# Altium schematic sheet Sheet3.SchDoc
size A4
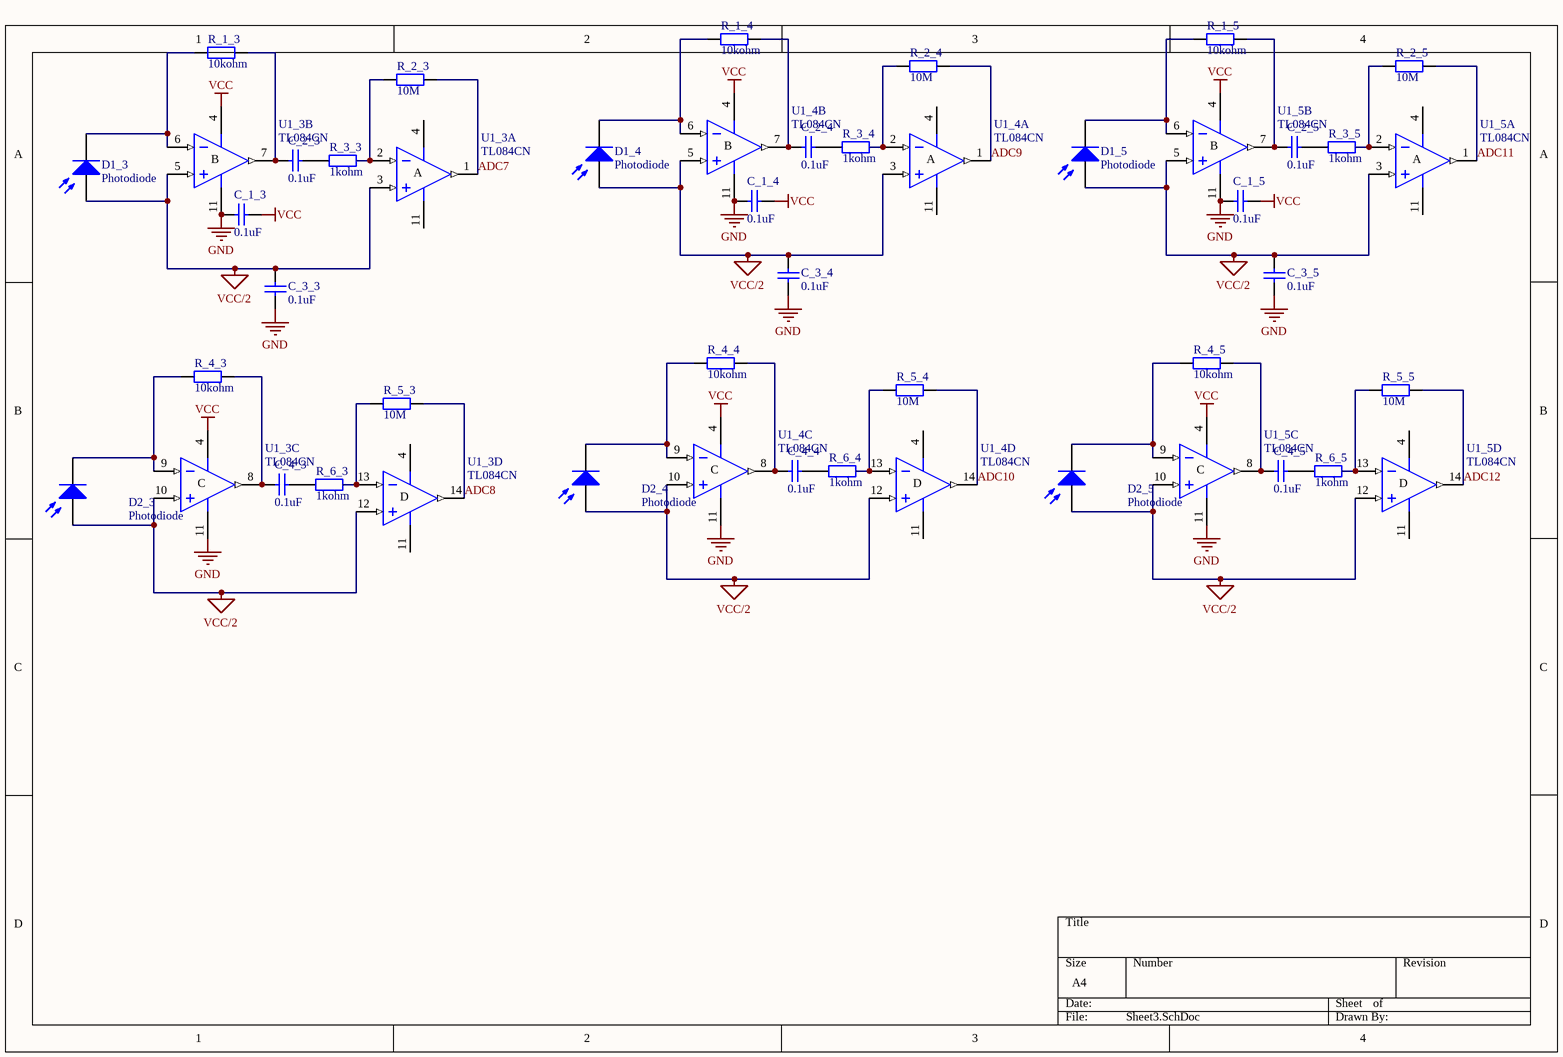
[diagram p0: Sheet3.SchDoc]

## Parts
C_1_3  0.1uF  [cms805 - mini]
C_1_4  0.1uF  [cms805 - mini]
C_1_5  0.1uF  [cms805 - mini]
C_2_3  0.1uF  [cms805 - mini]
C_2_4  0.1uF  [cms805 - mini]
C_2_5  0.1uF  [cms805 - mini]
C_3_3  0.1uF  [cms805 - mini]
C_3_4  0.1uF  [cms805 - mini]
C_3_5  0.1uF  [cms805 - mini]
C_4_3  0.1uF  [cms805 - mini]
C_4_4  0.1uF  [cms805 - mini]
C_4_5  0.1uF  [cms805 - mini]
D1_3  Photodiode  [TEMD1000]
D1_4  Photodiode  [TEMD1000]
D1_5  Photodiode  [TEMD1000]
D2_3  Photodiode  [TEMD1000]
D2_4  Photodiode  [TEMD1000]
D2_5  Photodiode  [TEMD1000]
R_1_3  10kohm  [cms805 - mini]
R_1_4  10kohm  [cms805 - mini]
R_1_5  10kohm  [cms805 - mini]
R_2_3  10M  [cms805 - mini]
R_2_4  10M  [cms805 - mini]
R_2_5  10M  [cms805 - mini]
R_3_3  1kohm  [cms805 - mini]
R_3_4  1kohm  [cms805 - mini]
R_3_5  1kohm  [cms805 - mini]
R_4_3  10kohm  [cms805 - mini]
R_4_4  10kohm  [cms805 - mini]
R_4_5  10kohm  [cms805 - mini]
R_5_3  10M  [cms805 - mini]
R_5_4  10M  [cms805 - mini]
R_5_5  10M  [cms805 - mini]
R_6_3  1kohm  [cms805 - mini]
R_6_4  1kohm  [cms805 - mini]
R_6_5  1kohm  [cms805 - mini]
U1_3  TL084CN  [TSSOP14]  (parts A,B,C,D of 4)
U1_4  TL084CN  [TSSOP14]  (parts A,B,C,D of 4)
U1_5  TL084CN  [TSSOP14]  (parts A,B,C,D of 4)

## Nets
GND: C_1_3.1 C_1_4.1 C_1_5.1 C_3_3.1 C_3_4.1 C_3_5.1 U1_3.11(V-) U1_4.11(V-) U1_5.11(V-)
VCC: C_1_3.2 C_1_4.2 C_1_5.2 U1_3.4(V+) U1_4.4(V+) U1_5.4(V+)
VCC/2: C_3_3.2 C_3_4.2 C_3_5.2 D1_3.1(A) D1_4.1(A) D1_5.1(A) D2_3.1(A) D2_4.1(A) D2_5.1(A) U1_3.3(IN+) U1_3.5(IN+) U1_3.10(IN+) U1_3.12(IN+) U1_4.3(IN+) U1_4.5(IN+) U1_4.10(IN+) U1_4.12(IN+) U1_5.3(IN+) U1_5.5(IN+) U1_5.10(IN+) U1_5.12(IN+)
ADC7: R_2_3.2 U1_3.1(OUT)
ADC8: R_5_3.2 U1_3.14(OUT)
ADC9: R_2_4.2 U1_4.1(OUT)
ADC10: R_5_4.2 U1_4.14(OUT)
ADC11: R_2_5.2 U1_5.1(OUT)
ADC12: R_5_5.2 U1_5.14(OUT)
NetC_2_3_1: C_2_3.1 R_3_3.1
NetC_2_3_2: C_2_3.2 R_1_3.2 U1_3.7(OUT)
NetC_2_4_1: C_2_4.1 R_3_4.1
NetC_2_4_2: C_2_4.2 R_1_4.2 U1_4.7(OUT)
NetC_2_5_1: C_2_5.1 R_3_5.1
NetC_2_5_2: C_2_5.2 R_1_5.2 U1_5.7(OUT)
NetC_4_3_1: C_4_3.1 R_6_3.1
NetC_4_3_2: C_4_3.2 R_4_3.2 U1_3.8(OUT)
NetC_4_4_1: C_4_4.1 R_6_4.1
NetC_4_4_2: C_4_4.2 R_4_4.2 U1_4.8(OUT)
NetC_4_5_1: C_4_5.1 R_6_5.1
NetC_4_5_2: C_4_5.2 R_4_5.2 U1_5.8(OUT)
NetD1_3_2: D1_3.2(K) R_1_3.1 U1_3.6(IN-)
NetD1_4_2: D1_4.2(K) R_1_4.1 U1_4.6(IN-)
NetD1_5_2: D1_5.2(K) R_1_5.1 U1_5.6(IN-)
NetD2_3_2: D2_3.2(K) R_4_3.1 U1_3.9(IN-)
NetD2_4_2: D2_4.2(K) R_4_4.1 U1_4.9(IN-)
NetD2_5_2: D2_5.2(K) R_4_5.1 U1_5.9(IN-)
NetR_2_3_1: R_2_3.1 R_3_3.2 U1_3.2(IN-)
NetR_2_4_1: R_2_4.1 R_3_4.2 U1_4.2(IN-)
NetR_2_5_1: R_2_5.1 R_3_5.2 U1_5.2(IN-)
NetR_5_3_1: R_5_3.1 R_6_3.2 U1_3.13(IN-)
NetR_5_4_1: R_5_4.1 R_6_4.2 U1_4.13(IN-)
NetR_5_5_1: R_5_5.1 R_6_5.2 U1_5.13(IN-)

## Notes on the sheet
- (in symbol TL084CN, part A) A
- (in symbol TL084CN, part B) B
- (in symbol TL084CN, part C) C
- (in symbol TL084CN, part D) D

## Library data of the parts
C_1_3-C_1_5 C_2_3-C_2_5 C_3_3-C_3_5 C_4_3-C_4_5 = Capa
R_1_3-R_1_5 R_2_3-R_2_5 R_3_3-R_3_5 R_4_3-R_4_5 R_5_3-R_5_5 R_6_3-R_6_5 = Resistance
U1_3-U1_5 = TL084CN: General-Purpose J-FET Quad Operational Amplifier; Published: 24-Aug-2001; LatestRevisionDate: 06-Jun-2005; LatestRevisionNote: Stylized 3D Model Added.; DatasheetVersion: Jan-1999; PackageVersion: Jan-1997; PackageReference: DIP14; Publisher: Altium Limited; PackageDescription: DIP; 14 Leads; Row Spacing 7.62 mm; Pitch 2.54 mm; ComponentLink1Description: Manufacturer Link; ComponentLink1URL: http://www.st.com/; ComponentLink2Description: Datasheet; ComponentLink2URL: http://www.st.com/stonline/products/literature/ds/2301/tl084.pdf
D1_3-D1_5 D2_3-D2_5 = Photodiode: Published: 24-Mar-1999; LatestRevisionDate: 17-Jul-2002; LatestRevisionNote: Re-released for DXP Platform.; PackageReference: PIN2; Publisher: Altium Limited